# Altium schematic sheet TypeC_2.54.SchDoc
size A4
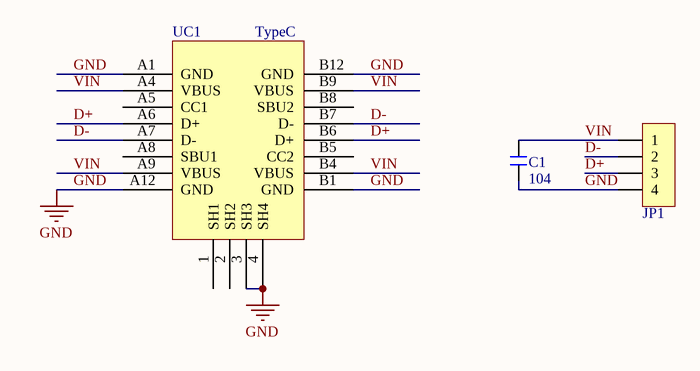
[diagram p0: TypeC_2.54.SchDoc]

## Parts
C1  104  [C 0603_L]
JP1  HDR-1X4  [HDR2.54-LI-4P]  (value not drawn)
UC1  TypeC  [Type-C_8.64.5.82.12pin]

## Nets
GND: C1.1 JP1.4 UC1.3(SH3) UC1.4(SH4) UC1.A1(GND) UC1.A12(GND) UC1.B1(GND) UC1.B12(GND)
D+: JP1.3 UC1.A6(D+) UC1.B6(D+)
D-: JP1.2 UC1.A7(D-) UC1.B7(D-)
VIN: C1.2 JP1.1 UC1.A4(VBUS) UC1.A9(VBUS) UC1.B4(VBUS) UC1.B9(VBUS)

Not connected (* = marked no-connect by the designer): UC1 1(SH1) 2(SH2) A5(CC1) A8(SBU1) B5(CC2) B8(SBU2)

## Library data of the parts
C1 = C: 无极性贴片电容; 版权归属: 源创客; 材质: X7R; BOM名称: 无极性贴片电容; 学习资源: www.ooocke.com
JP1 = Header 4: 4P接插件; 版权归属: 源创客; BOM名称: 4P接插件; 学习资源: www.ooocke.com
UC1 = USB_Type-C: TypeC_SinglePin_Short